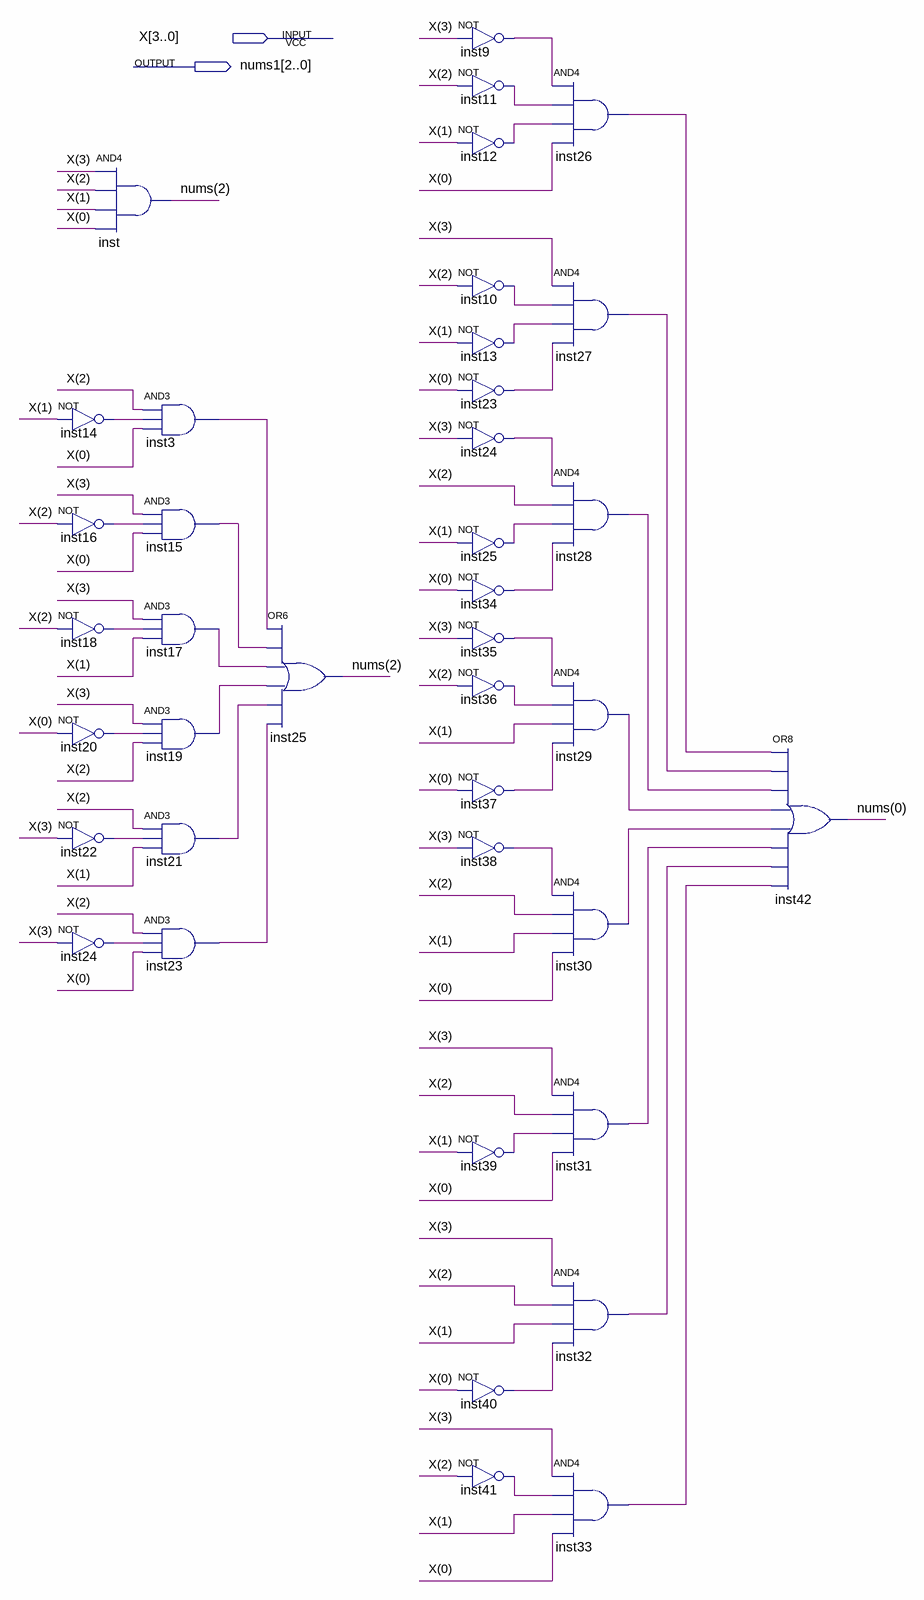
[diagram p0: schematic sheet]
// Quartus schematic G53_num1s.bdf as structural Verilog: 39 symbols, 2 pins
module G53_num1s (
  input  [3:0] X,
  output [2:0] nums1
);

  wire inst3_out, inst9_out, inst10_out, inst11_out, inst12_out, inst13_out, inst14_out, inst15_out,
       inst16_out, inst17_out, inst18_out, inst19_out, inst20_out, inst21_out, inst22_out, inst23_out,
       inst23_out_2, inst24_out, inst24_out_2, inst25_out, inst26_out, inst27_out, inst28_out, inst29_out,
       inst30_out, inst31_out, inst32_out, inst33_out, inst34_out, inst35_out, inst36_out, inst37_out,
       inst38_out, inst39_out, inst40_out, inst41_out, \nums(0) , \nums(2) , \X(0) , \X(1) , \X(2) , \X(3) ;

  not inst14 (inst14_out, \X(1) );
  not inst16 (inst16_out, \X(2) );
  not inst18 (inst18_out, \X(2) );
  not inst20 (inst20_out, \X(0) );
  not inst22 (inst22_out, \X(3) );
  not inst24 (inst24_out_2, \X(3) );
  and inst (\nums(2) , \X(3) , \X(2) , \X(1) , \X(0) );
  and inst3 (inst3_out, \X(2) , inst14_out, \X(0) );
  and inst15 (inst15_out, \X(3) , inst16_out, \X(0) );
  and inst17 (inst17_out, \X(3) , inst18_out, \X(1) );
  and inst19 (inst19_out, \X(3) , inst20_out, \X(2) );
  and inst21 (inst21_out, \X(2) , inst22_out, \X(1) );
  and inst23 (inst23_out_2, \X(2) , inst24_out_2, \X(0) );
  or inst25 (\nums(2) , inst3_out, inst15_out, inst17_out, inst19_out, inst21_out, inst23_out_2);
  not inst9 (inst9_out, \X(3) );
  not inst11 (inst11_out, \X(2) );
  not inst12 (inst12_out, \X(1) );
  not inst10 (inst10_out, \X(2) );
  not inst13 (inst13_out, \X(1) );
  not inst23_dup2 (inst23_out, \X(0) );
  not inst24_dup2 (inst24_out, \X(3) );
  not inst25_dup2 (inst25_out, \X(1) );
  not inst34 (inst34_out, \X(0) );
  not inst35 (inst35_out, \X(3) );
  not inst36 (inst36_out, \X(2) );
  not inst37 (inst37_out, \X(0) );
  not inst38 (inst38_out, \X(3) );
  not inst39 (inst39_out, \X(1) );
  not inst40 (inst40_out, \X(0) );
  not inst41 (inst41_out, \X(2) );
  and inst26 (inst26_out, inst9_out, inst11_out, inst12_out, \X(0) );
  and inst27 (inst27_out, \X(3) , inst10_out, inst13_out, inst23_out);
  and inst28 (inst28_out, inst24_out, \X(2) , inst25_out, inst34_out);
  and inst29 (inst29_out, inst35_out, inst36_out, \X(1) , inst37_out);
  and inst30 (inst30_out, inst38_out, \X(2) , \X(1) , \X(0) );
  and inst31 (inst31_out, \X(3) , \X(2) , inst39_out, \X(0) );
  and inst32 (inst32_out, \X(3) , \X(2) , \X(1) , inst40_out);
  and inst33 (inst33_out, \X(3) , inst41_out, \X(1) , \X(0) );
  or inst42 (\nums(0) , inst26_out, inst27_out, inst28_out, inst29_out, inst30_out, inst31_out, inst32_out, inst33_out);
endmodule
